# Altium schematic sheet Sheet4.SchDoc: Наименование
size 420 x 297 mm; ApprovedBy: Vasil; CheckedBy: Vasil; Author: Vasil; CompanyName: Vasil; DrawnBy: n.a.; Engineer: Vasil; SheetNumber: 4; SheetTotal: 5; PageSetup: Record=PageOptions|CenterHorizontal=True|CenterVertical=True|PrintScale=0.94|XCorrection=1.00|YCorrection=1.00|PrintKind=1|BorderSize=5000000|LeftOffset=0|BottomOffset=0|Orientation=1|PaperLength=1000|PaperWidth=1000|Scale=100|PaperSource=7|PrintQuality=-4|MediaType=1|DitherType=10|PaperKind=A4|PrintScaleMode=1; DecimalNumber: 000.00006.001.VG; HeadOfSector: n.a.; MainDevice: HW; Name: CNC_interfaces_board; DocumentName: Sheet1.SCHDOC
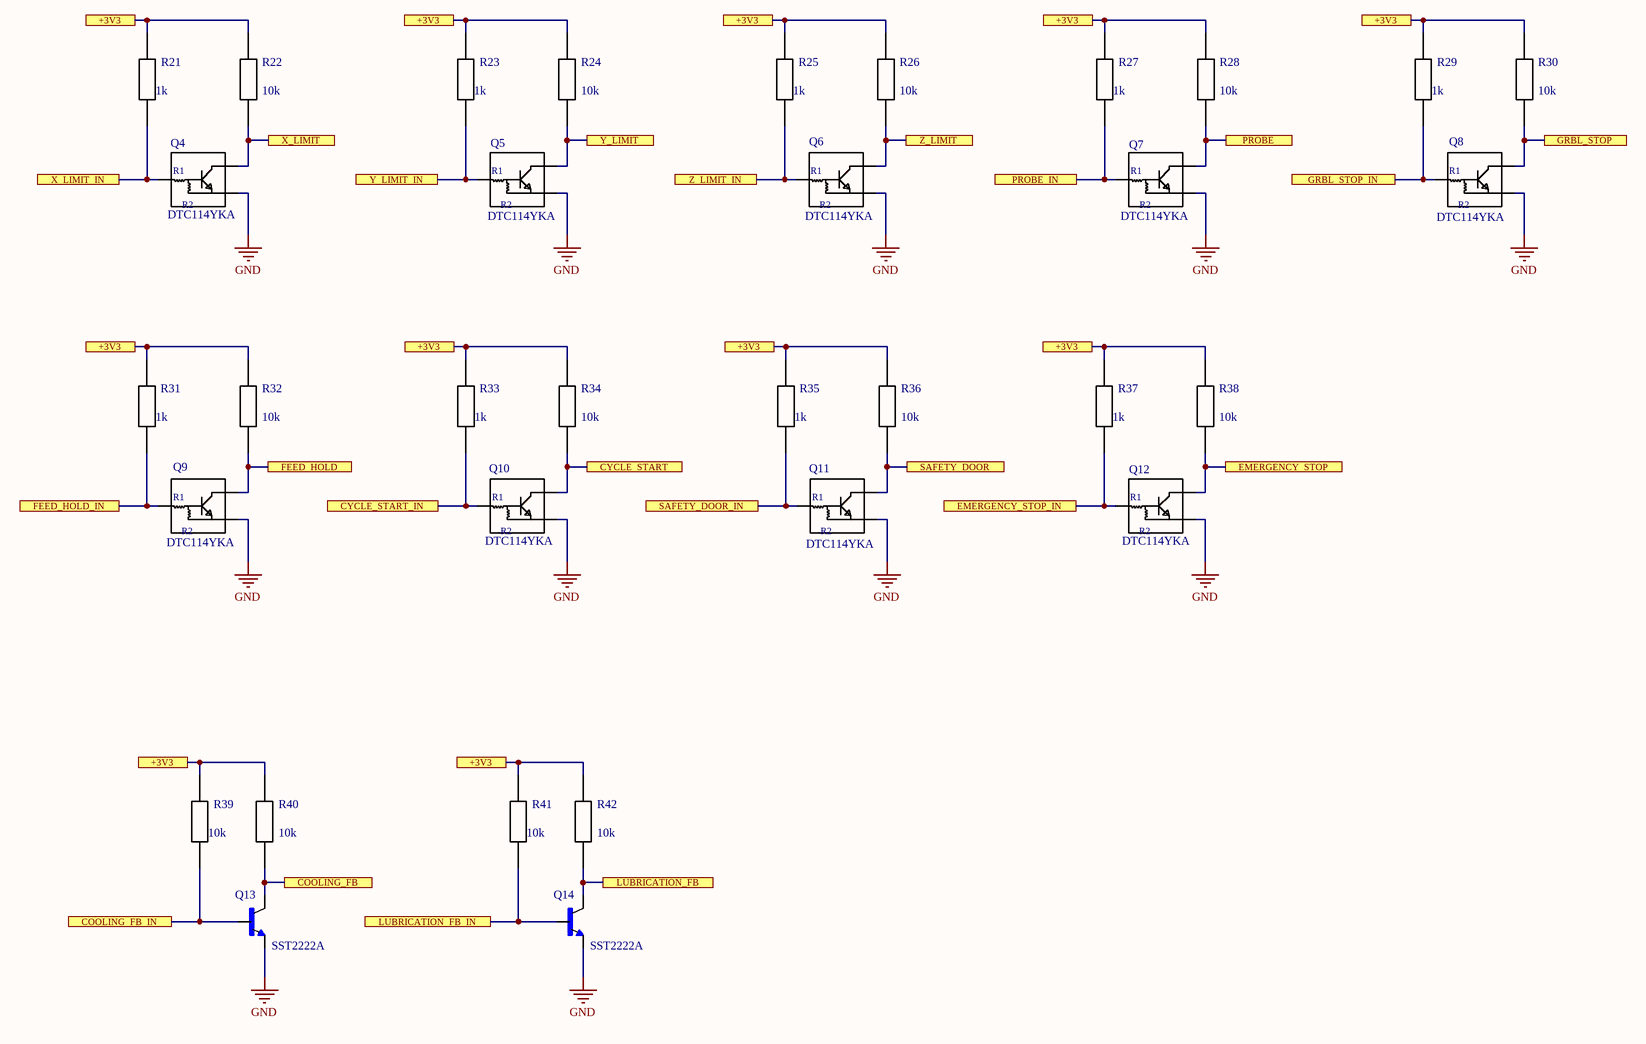
[diagram p0: Sheet4.SchDoc]

## Parts
Q4  DTC114YKA  [SOT-346 (SC59) Black]
Q5  DTC114YKA  [SOT-346 (SC59) Black]
Q6  DTC114YKA  [SOT-346 (SC59) Black]
Q7  DTC114YKA  [SOT-346 (SC59) Black]
Q8  DTC114YKA  [SOT-346 (SC59) Black]
Q9  DTC114YKA  [SOT-346 (SC59) Black]
Q10  DTC114YKA  [SOT-346 (SC59) Black]
Q11  DTC114YKA  [SOT-346 (SC59) Black]
Q12  DTC114YKA  [SOT-346 (SC59) Black]
Q13  SST2222A  [SOT-23-3]
Q14  SST2222A  [SOT-23-3]
R21  1k  [SMD 0805]
R22  10k  [SMD 0805]
R23  1k  [SMD 0805]
R24  10k  [SMD 0805]
R25  1k  [SMD 0805]
R26  10k  [SMD 0805]
R27  1k  [SMD 0805]
R28  10k  [SMD 0805]
R29  1k  [SMD 0805]
R30  10k  [SMD 0805]
R31  1k  [SMD 0805]
R32  10k  [SMD 0805]
R33  1k  [SMD 0805]
R34  10k  [SMD 0805]
R35  1k  [SMD 0805]
R36  10k  [SMD 0805]
R37  1k  [SMD 0805]
R38  10k  [SMD 0805]
R39  10k  [SMD 0805]
R40  10k  [SMD 0805]
R41  10k  [SMD 0805]
R42  10k  [SMD 0805]

## Ports
+3V3, COOLING_FB, COOLING_FB_IN, CYCLE_START, CYCLE_START_IN, EMERGENCY_STOP, EMERGENCY_STOP_IN, FEED_HOLD, FEED_HOLD_IN, GRBL_STOP, GRBL_STOP_IN, LUBRICATION_FB, LUBRICATION_FB_IN, PROBE, PROBE_IN, SAFETY_DOOR, SAFETY_DOOR_IN, X_LIMIT, X_LIMIT_IN, Y_LIMIT, Y_LIMIT_IN, Z_LIMIT, Z_LIMIT_IN

## Nets
GND: Q4.2 Q5.2 Q6.2 Q7.2 Q8.2 Q9.2 Q10.2 Q11.2 Q12.2 Q13.2(E) Q14.2(E)
+3V3: R21.1 R22.1 R23.1 R24.1 R25.1 R26.1 R27.1 R28.1 R29.1 R30.1 R31.1 R32.1 R33.1 R34.1 R35.1 R36.1 R37.1 R38.1 R39.1 R40.1 R41.1 R42.1 ; port +3V3
COOLING_FB: Q13.3(C) R40.2 ; port COOLING_FB
COOLING_FB_IN: Q13.1(B) R39.2 ; port COOLING_FB_IN
CYCLE_START: Q10.3 R34.2 ; port CYCLE_START
CYCLE_START_IN: Q10.1 R33.2 ; port CYCLE_START_IN
EMERGENCY_STOP: Q12.3 R38.2 ; port EMERGENCY_STOP
EMERGENCY_STOP_IN: Q12.1 R37.2 ; port EMERGENCY_STOP_IN
FEED_HOLD: Q9.3 R32.2 ; port FEED_HOLD
FEED_HOLD_IN: Q9.1 R31.2 ; port FEED_HOLD_IN
GRBL_STOP: Q8.3 R30.2 ; port GRBL_STOP
GRBL_STOP_IN: Q8.1 R29.2 ; port GRBL_STOP_IN
LUBRICATION_FB: Q14.3(C) R42.2 ; port LUBRICATION_FB
LUBRICATION_FB_IN: Q14.1(B) R41.2 ; port LUBRICATION_FB_IN
PROBE: Q7.3 R28.2 ; port PROBE
PROBE_IN: Q7.1 R27.2 ; port PROBE_IN
SAFETY_DOOR: Q11.3 R36.2 ; port SAFETY_DOOR
SAFETY_DOOR_IN: Q11.1 R35.2 ; port SAFETY_DOOR_IN
X_LIMIT: Q4.3 R22.2 ; port X_LIMIT
X_LIMIT_IN: Q4.1 R21.2 ; port X_LIMIT_IN
Y_LIMIT: Q5.3 R24.2 ; port Y_LIMIT
Y_LIMIT_IN: Q5.1 R23.2 ; port Y_LIMIT_IN
Z_LIMIT: Q6.3 R26.2 ; port Z_LIMIT
Z_LIMIT_IN: Q6.1 R25.2 ; port Z_LIMIT_IN

## Notes on the sheet
- Перв.примен.
- Справ.№
- Подп. и дата
- Инв.№ дубл.
- Взам.инв.№
- Подп.и дата
- Разраб.
- Изм.
- Лист
- № докум.
- Подп.
- Дата
- Лит.
- Масштаб
- Масса
- Т.контр.
- Пров.
- СХЕМА   ЭЛЕКТРИЧЕСКАЯ
- ПРИНЦИПИАЛЬНАЯ
- Листов
- Инв.№ подл.
- Утв.
- Н.контр.
- Нач.сект.
- Формат  A3
- (in symbol DTC114YKA) R1; R2

## Library data of the parts
Q4-Q12 = DTC114YKA: NPN Digital 50V 100mA 200mW  R1=10kOm R2=47kOm; Manufacturer: ROHM Semiconductor; Case: SOT-346 (SC59); HalpURL: https://store.comet.bg/Catalogue/Product/23715/; Value: DTC114YKA
Q13 Q14 = SST2222A: Transistor NPN 40V 600mA 300MHz 350mW; Manufacturer: ROHM Semiconductor; Case: SOT-23-3 SST3; HelpURL: https://store.comet.bg/Catalogue/Product/23715/; Value: SST2222A
R21-R42 = Resistor_1: RES; HelpURL: https://store.comet.bg/Catalogue/RES/Resistors/#eyJpcHAiOiIxMDAiLCJtIjoiIn0%3D
  R21 R23 R25 R27 R29 R31 R33 R35 R37: Value: 1k
  R22 R24 R26 R28 R30 R32 R34 R36 R38-R42: Value: 10k